# Altium project LED_PCB_v1.0.PrjPcb
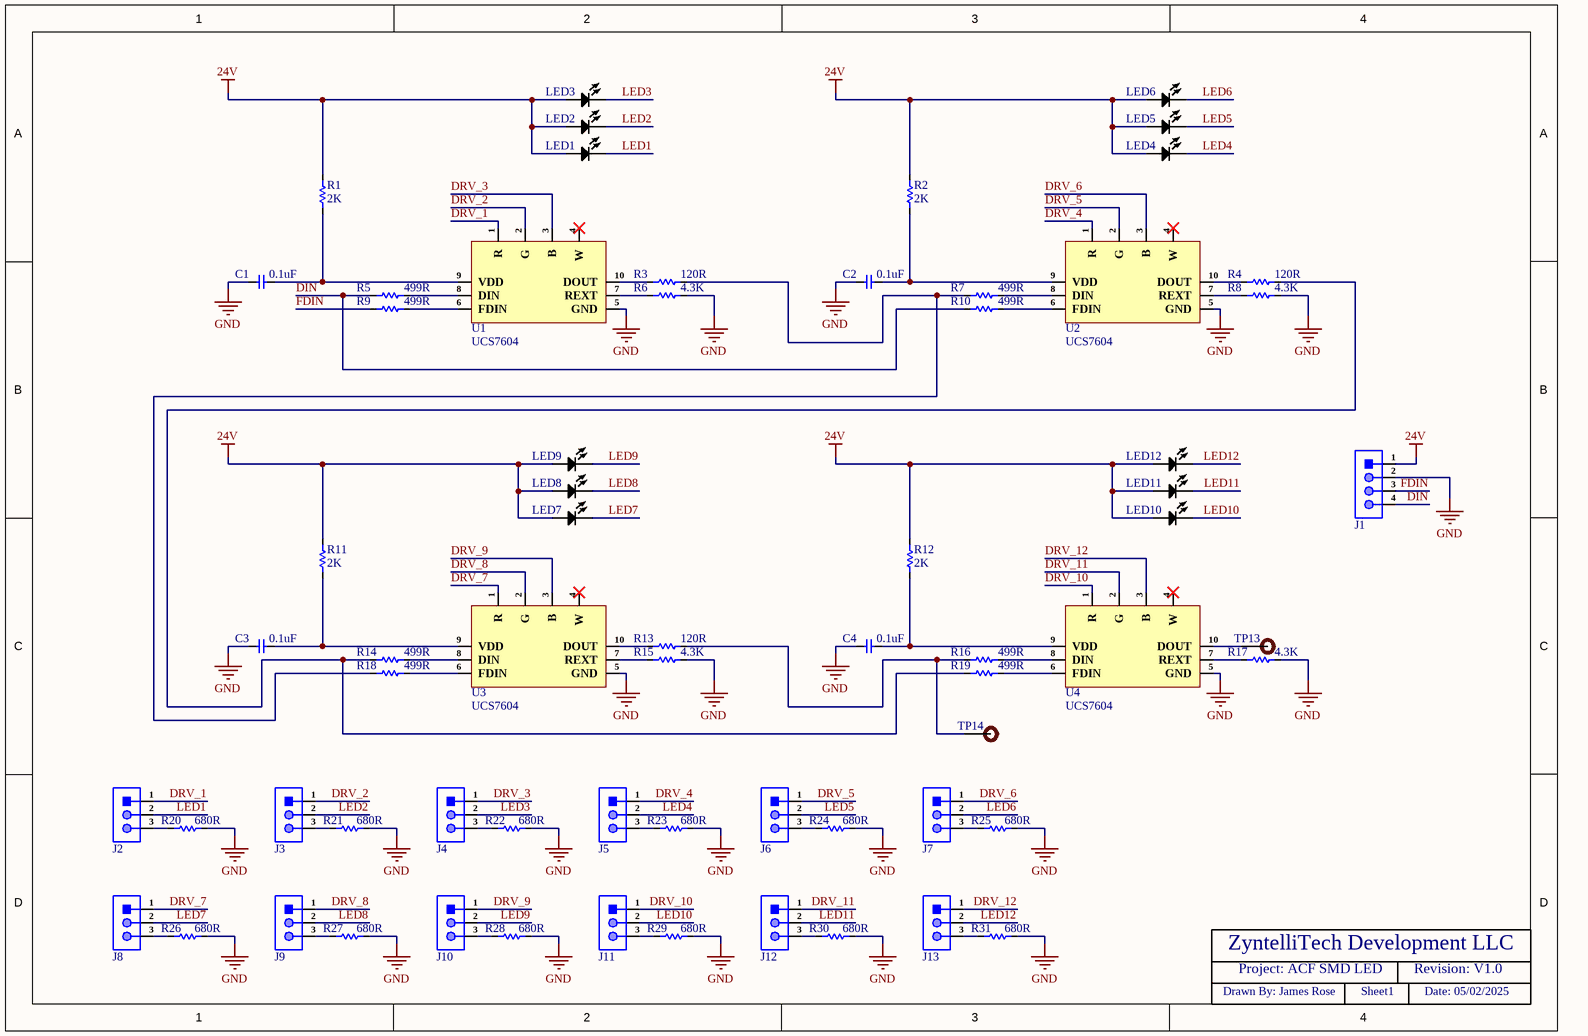
[diagram p0: Sheet1.SchDoc]
1 sheet, 66 parts. Net scope: global (net labels, ports and power ports of the same name join across sheets).
Board file: LED_PCB_v1.0.PcbDoc

## Sheet Sheet1.SchDoc
size A4; DrawnBy: James Rose; SheetNumber: 1; SheetTotal: 1; Validator: James Rose

### Parts
C1  0.1uF  [Cap-0603]
C2  0.1uF  [Cap-0603]
C3  0.1uF  [Cap-0603]
C4  0.1uF  [Cap-0603]
J1  X6511WV-04H-C60D30  [HDR1X4_]  (value not drawn)
J2  X6511WV-03H-C60D30  [HDR1X3_]  (value not drawn)
J3  X6511WV-03H-C60D30  [HDR1X3_]  (value not drawn)
J4  X6511WV-03H-C60D30  [HDR1X3_]  (value not drawn)
J5  X6511WV-03H-C60D30  [HDR1X3_]  (value not drawn)
J6  X6511WV-03H-C60D30  [HDR1X3_]  (value not drawn)
J7  X6511WV-03H-C60D30  [HDR1X3_]  (value not drawn)
J8  X6511WV-03H-C60D30  [HDR1X3_]  (value not drawn)
J9  X6511WV-03H-C60D30  [HDR1X3_]  (value not drawn)
J10  X6511WV-03H-C60D30  [HDR1X3_]  (value not drawn)
J11  X6511WV-03H-C60D30  [HDR1X3_]  (value not drawn)
J12  X6511WV-03H-C60D30  [HDR1X3_]  (value not drawn)
J13  X6511WV-03H-C60D30  [HDR1X3_]  (value not drawn)
LED1  5050 LED  [5050 LED]  (value not drawn)
LED2  5050 LED  [5050 LED]  (value not drawn)
LED3  5050 LED  [5050 LED]  (value not drawn)
LED4  5050 LED  [5050 LED]  (value not drawn)
LED5  5050 LED  [5050 LED]  (value not drawn)
LED6  5050 LED  [5050 LED]  (value not drawn)
LED7  5050 LED  [5050 LED]  (value not drawn)
LED8  5050 LED  [5050 LED]  (value not drawn)
LED9  5050 LED  [5050 LED]  (value not drawn)
LED10  5050 LED  [5050 LED]  (value not drawn)
LED11  5050 LED  [5050 LED]  (value not drawn)
LED12  5050 LED  [5050 LED]  (value not drawn)
R1  2K  [Res-1206]
R2  2K  [Res-1206]
R3  120R  [Res-0603]
R4  120R  [Res-0603]
R5  499R  [Res-0603]
R6  4.3K  [Res-0402]
R7  499R  [Res-0603]
R8  4.3K  [Res-0402]
R9  499R  [Res-0603]
R10  499R  [Res-0603]
R11  2K  [Res-1206]
R12  2K  [Res-1206]
R13  120R  [Res-0603]
R14  499R  [Res-0603]
R15  4.3K  [Res-0402]
R16  499R  [Res-0603]
R17  4.3K  [Res-0402]
R18  499R  [Res-0603]
R19  499R  [Res-0603]
R20  680R  [Res-0603]
R21  680R  [Res-0603]
R22  680R  [Res-0603]
R23  680R  [Res-0603]
R24  680R  [Res-0603]
R25  680R  [Res-0603]
R26  680R  [Res-0603]
R27  680R  [Res-0603]
R28  680R  [Res-0603]
R29  680R  [Res-0603]
R30  680R  [Res-0603]
R31  680R  [Res-0603]
TP13  0.5mm Test Pad  [0.5mm Test Pad]  (value not drawn)  (no BOM)
TP14  0.5mm Test Pad  [0.5mm Test Pad]  (value not drawn)  (no BOM)
U1  UCS7604  [SOP-10]
U2  UCS7604  [SOP-10]
U3  UCS7604  [SOP-10]
U4  UCS7604  [SOP-10]

### Nets
24V: J1.1 LED1.A LED2.A LED3.A LED4.A LED5.A LED6.A LED7.A LED8.A LED9.A LED10.A LED11.A LED12.A R1.2 R2.2 R11.2 R12.2
GND: C1.1 C2.1 C3.1 C4.1 J1.2 R6.2 R8.2 R15.2 R17.2 R20.2 R21.2 R22.2 R23.2 R24.2 R25.2 R26.2 R27.2 R28.2 R29.2 R30.2 R31.2 U1.5(GND) U2.5(GND) U3.5(GND) U4.5(GND)
DIN: J1.4 R5.1 R10.1
DRV_1: J2.1 U1.1(R)
DRV_2: J3.1 U1.2(G)
DRV_3: J4.1 U1.3(B)
DRV_4: J5.1 U2.1(R)
DRV_5: J6.1 U2.2(G)
DRV_6: J7.1 U2.3(B)
DRV_7: J8.1 U3.1(R)
DRV_8: J9.1 U3.2(G)
DRV_9: J10.1 U3.3(B)
DRV_10: J11.1 U4.1(R)
DRV_11: J12.1 U4.2(G)
DRV_12: J13.1 U4.3(B)
FDIN: J1.3 R9.1
LED1: J2.2 LED1.K
LED2: J3.2 LED2.K
LED3: J4.2 LED3.K
LED4: J5.2 LED4.K
LED5: J6.2 LED5.K
LED6: J7.2 LED6.K
LED7: J8.2 LED7.K
LED8: J9.2 LED8.K
LED9: J10.2 LED9.K
LED10: J11.2 LED10.K
LED11: J12.2 LED11.K
LED12: J13.2 LED12.K
NetC1_2: C1.2 R1.1 U1.9(VDD)
NetC2_2: C2.2 R2.1 U2.9(VDD)
NetC3_2: C3.2 R11.1 U3.9(VDD)
NetC4_2: C4.2 R12.1 U4.9(VDD)
NetJ2_3: J2.3 R20.1
NetJ3_3: J3.3 R21.1
NetJ4_3: J4.3 R22.1
NetJ5_3: J5.3 R23.1
NetJ6_3: J6.3 R24.1
NetJ7_3: J7.3 R25.1
NetJ8_3: J8.3 R26.1
NetJ9_3: J9.3 R27.1
NetJ10_3: J10.3 R28.1
NetJ11_3: J11.3 R29.1
NetJ12_3: J12.3 R30.1
NetJ13_3: J13.3 R31.1
NetR3_1: R3.1 U1.10(DOUT)
NetR3_2: R3.2 R7.1 R18.1
NetR4_1: R4.1 U2.10(DOUT)
NetR4_2: R4.2 R14.1 R19.1
NetR5_2: R5.2 U1.8(DIN)
NetR6_1: R6.1 U1.7(REXT)
NetR7_2: R7.2 U2.8(DIN)
NetR8_1: R8.1 U2.7(REXT)
NetR9_2: R9.2 U1.6(FDIN)
NetR10_2: R10.2 U2.6(FDIN)
NetR13_1: R13.1 U3.10(DOUT)
NetR13_2: R13.2 R16.1 TP14.1
NetR14_2: R14.2 U3.8(DIN)
NetR15_1: R15.1 U3.7(REXT)
NetR16_2: R16.2 U4.8(DIN)
NetR17_1: R17.1 U4.7(REXT)
NetR18_2: R18.2 U3.6(FDIN)
NetR19_2: R19.2 U4.6(FDIN)
NetTP13_1: TP13.1 U4.10(DOUT)

Not connected (* = marked no-connect by the designer): U1 4(W)*; U2 4(W)*; U3 4(W)*; U4 4(W)*

### Notes on the sheet
- ZyntelliTech Development LLC
- Project: ACF SMD LED
- Revision: V1.0
- Drawn By: James Rose
- Sheet1
- Date: 05/02/2025
- DWG. NO.
- REV.
- SHT.
- THIS DOCUMENT AND THE DATA DISCLOSED HEREIN OR HEREWITH IS THE PROPERTY OF ALTIUM LIMITED AND MAY BE FREELY DISTRIBUTED IN WHOLE. NO RIGHTS ARE RESERVED OR EXPRESS OR IMPLIED WARANTEE GIVEN.
- REVISION
- DESCRIPTION
- DATE
- APPROVED
- ENG:
- APPROVALS
- PROJECT
- DSN:
- CHK:
- REFERENCE DOCUMENTS
- PROJECT REVISION:
- TITLE
- DOCUMENT REVISION:
- DESIGN ITEM:
- BOM:
- FAB DWG:
- PCB DWG:
- ASSY DWG:
- SCALE:
- SIZE
- B
- CAGE CODE
- FILE NAME
- DWG NO.
- SHEET
- OF
- REV

### Library data of the parts
C1-C4 = CC0603JRX7R9BB104: CAP CER 0.1UF 50V X7R 0603; Manufacturer: Yageo; Item Type: Capacitors; Material: 4241ConductorMaterial; Supplier: Future Electronics; LCSC Part Number: C91183; Manufacturer Part Number: CC0603JRX7R9BB104; RoHS: Yes; Stock: 204000; Pricing: 4000=0.0077, 16000=0.0073, 60000=0.007, 160000=0.0068, 400000=0.0064 (USD); Pins: 2NUMBER; Lead Free: 5697LeadFree; Halogen Free: 5694HalogenFree; ComponentLink1URL: https://datasheet.ciiva.com/11465/upy-gphc-x7r-6-3v-to-50v-8-11465038.pdf?src-supplier=Avnet; ComponentLink1Description: https://datasheet.ciiva.com/11465/upy-gphc-x7r-6-3v-to-50v-8-11465038.pdf?src-supplier=Avnet
J1 = X6511WV-04H-C60D30: Gold 250V 3A Straight Square Pins 2.5mm 4P 260℃ 6mm -40℃~+105℃ 3mm 2.54mm Plugin Black Brass 1x4P Plugin,P=2.54mm Pin Headers ROHS; Manufacturer: XKB; Item Type: Male Header; ComponentLink1Description: LCSC; ComponentLink1URL: https://www.lcsc.com/product-detail/Pin-Headers_XKB-Connectivity-X6511WV-04H-C60D30_C706876.html; Manufacturer Part Number: X6511WV-04H-C60D30; Package: Plugin,P=2.54mm; LCSC Part Number: C706876
J2-J13 = X6511WV-03H-C60D30: Gold 250V 3A Straight Square Pins 2.5mm 3P 260℃ 6mm -40℃~+105℃ 3mm 2.54mm Plugin Black Brass 1x3P Plugin,P=2.54mm Pin Headers ROHS; Manufacturer: XKB; Item Type: Male Header; Manufacturer Part Number: X6511WV-03H-C60D30; Package: Plugin,P=2.54mm; LCSC Part Number: C706875; ComponentLink1Description: LCSC; ComponentLink1URL: https://www.lcsc.com/product-detail/Pin-Headers_XKB-Connectivity-X6511WV-03H-C60D30_C706875.html
LED1-LED12 = 5050 LED: -; ComponentLink1Description: LCSC; ComponentLink1URL: *
R1 R2 R11 R12 = RC1206FR-072KL: RES 2K OHM 1% 1/4W 1206; Manufacturer: Yageo; Item Type: Resistors; Value: 2kR; Power Rating: 250mW; Voltage Rating: 200V; Temperature Coefficient: 100ppm/°C; Supplier: Future Electronics; LCSC Part Number: C133543; Manufacturer Part Number: RC1206FR-072KL; RoHS: Yes; Stock: 45000; Pricing: 5000=0.003, 20000=0.0029, 75000=0.0028, 150000=0.0027, 375000=0.0026 (USD); Mounting Technology: Surface Mount; Case/Package: 1206; Case Code (Imperial): 1206; Case Code (Metric): 3216; Min Operating Temperature: -55°C; Max Operating Temperature: 155°C; Tolerance: 1%; Packaging: Tape and Reel; Termination: SMD/SMT; Working Voltage: 200V; Number of Terminations: 2; Features: Moisture Resistant; Series: RC; Max Power Dissipation: 250mW; Technology: THICK FILM; Voltage Rating (DC): 200V; Length: 3.1mm; Width: 1.6mm; Height: 0.55mm; Depth: 1.6mm; RoHS Compliant: Yes; Lead Free: 5697LeadFree; ComponentLink1URL: https://datasheet.ciiva.com/11808/0900766b80c6630a-11808949.pdf?src-supplier=Rs; ComponentLink1Description: https://datasheet.ciiva.com/11808/0900766b80c6630a-11808949.pdf?src-supplier=Rs; ComponentLink2URL: https://datasheet.ciiva.com/16740/pyu-rc1206-51-rohs-l-4-16740842.pdf?src-supplier=Future+Electronics; ComponentLink2Description: https://datasheet.ciiva.com/16740/pyu-rc1206-51-rohs-l-4-16740842.pdf?src-supplier=Future+Electronics
R3 R4 R13 = RC0603FR-07120RL: RES 120 OHM 1% 1/10W 0603; Manufacturer: Yageo; Temperature Coefficient: 100ppm/°C; Voltage Rating (DC): 50V; Power Rating: 100mW; Item Type: Resistor; Supplier 1: Digi-Key; Manufacturer Part Number: RC0603FR-07120RL; RoHS: Yes; Category: Chip SMD Resistors; Stock 1: 839061; Pricing 1: 1=0.10000, 10=0.02400, 100=0.00970, 1000=0.00436, 2500=0.00378 (USD); Case/Package: 0603; Number of Pins: 2; Case Code (Metric): 1608; Case Code (Imperial): 0603; Size Code: 0603; Min Operating Temperature: -55°C; Max Operating Temperature: 155°C; Resistance: 120R; Tolerance: 1%; Resistor Type: Thick Film; Packaging: Tape and Reel; Voltage Rating: 50V; Package Quantity: 1; Number of Terminations: 2; Termination: SMD/SMT; Max Power Dissipation: 100mW; Features: Moisture Resistant; Series: RC; Construction: Rectangular; Resistance Tolerance: 1%; Length: 1.6mm; Width: 0.031inch; Height: 0.022inch; Depth: 0.8mm; REACH SVHC: No SVHC; Lead Free: Lead Free; Military Standard: Not; RoHS Compliant: Yes; ComponentLink1URL: https://datasheet.ciiva.com/2553/pyu-r-int-thick-7-2553512.pdf?src-supplier=Digi-Key; ComponentLink1Description: https://datasheet.ciiva.com/2553/pyu-r-int-thick-7-2553512.pdf?src-supplier=Digi-Key; ComponentLink2URL: https://datasheet.ciiva.com/7746/443971-7746248.pdf?src-supplier=Element14; ComponentLink2Description: https://datasheet.ciiva.com/7746/443971-7746248.pdf?src-supplier=Element14; ComponentLink3URL: https://datasheet.ciiva.com/2553/pyu-r-int-thick-7-2553513.pdf?src-supplier=Digi-Key; ComponentLink3Description: https://datasheet.ciiva.com/2553/pyu-r-int-thick-7-2553513.pdf?src-supplier=Digi-Key; ComponentLink4URL: https://datasheet.ciiva.com/7746/443971-7746249.pdf?src-supplier=Element14; ComponentLink4Description: https://datasheet.ciiva.com/7746/443971-7746249.pdf?src-supplier=Element14; ComponentLink5URL: https://datasheet.ciiva.com/2553/pyu-r-int-thick-7-2553514.pdf?src-supplier=Digi-Key; ComponentLink5Description: https://datasheet.ciiva.com/2553/pyu-r-int-thick-7-2553514.pdf?src-supplier=Digi-Key; ComponentLink6URL: https://datasheet.ciiva.com/46395/443971-46395021.pdf?src-supplier=Element14; ComponentLink6Description: https://datasheet.ciiva.com/46395/443971-46395021.pdf?src-supplier=Element14; Supplier Part Number 1: 311-120HRCT-ND; LCSC Part Number: C114640
R5 R7 R9 R10 R14 R16 R18 R19 = RC0603FR-07499RL: RES 499 OHM 1% 1/10W 0603; Manufacturer: Yageo; Temperature Coefficient: 100ppm/°C; Power Rating: 100mW; Voltage Rating: 50V; Supplier 1: RSComponents; Manufacturer Part Number: RC0603FR-07499RL; RoHS: Yes; Category: Chip SMD Resistors; Stock 1: 900; Pricing 1: 5000=0.00300, 10000=0.00300, 15000=0.00300, 20000=0.00200 (GBP); Mount: Surface Mount; Case/Package: 0603; Contact Plating: Tin,Matte; Case Code (Metric): 1608; Case Code (Imperial): 0603; Size Code: 0603; Min Operating Temperature: -55°C; Max Operating Temperature: 155°C; Resistance: 499R; Tolerance: 1%; Resistor Type: Thick Film; Package Quantity: 1; Packaging: Tape and Reel; Number of Terminations: 2; Termination: SMD/SMT; Max Power Dissipation: 100mW; Voltage Rating (DC): 50V; Features: Moisture Resistant; Series: RC; Construction: Rectangular; Technology: THICK FILM; Length: 1.6mm; Width: 0.031inch; Height: 0.45mm; Depth: 0.8mm; Radiation Hardening: No; Military Standard: Not; Lead Free: Lead Free; RoHS Compliant: Yes; ComponentLink1URL: https://datasheet.ciiva.com/11808/0900766b80f96399-11808558.pdf?src-supplier=RSComponents; ComponentLink1Description: https://datasheet.ciiva.com/11808/0900766b80f96399-11808558.pdf?src-supplier=RSComponents; ComponentLink2URL: https://datasheet.ciiva.com/2453/pyu-r-int-thick-7-2453956.pdf?src-supplier=Digi-Key; ComponentLink2Description: https://datasheet.ciiva.com/2453/pyu-r-int-thick-7-2453956.pdf?src-supplier=Digi-Key; ComponentLink3URL: https://datasheet.ciiva.com/2453/pyu-r-int-thick-7-2453957.pdf?src-supplier=Digi-Key; ComponentLink3Description: https://datasheet.ciiva.com/2453/pyu-r-int-thick-7-2453957.pdf?src-supplier=Digi-Key; ComponentLink4URL: https://datasheet.ciiva.com/2453/pyu-r-int-thick-7-2453955.pdf?src-supplier=Digi-Key; ComponentLink4Description: https://datasheet.ciiva.com/2453/pyu-r-int-thick-7-2453955.pdf?src-supplier=Digi-Key; ComponentLink5URL: https://datasheet.ciiva.com/12558/rc0603-272842-12558391.pdf?src-supplier=Mouser; ComponentLink5Description: https://datasheet.ciiva.com/12558/rc0603-272842-12558391.pdf?src-supplier=Mouser; ComponentLink6URL: https://datasheet.ciiva.com/8885/pyu-rc0603-51-rohs-l-4-8885483.pdf?src-supplier=Avnet; ComponentLink6Description: https://datasheet.ciiva.com/8885/pyu-rc0603-51-rohs-l-4-8885483.pdf?src-supplier=Avnet; Supplier Part Number 1: 1995585; LCSC Part Number: C137714
R6 R8 R15 R17 = RC0402FR-074K3L: RES 4.3K OHM 1% 1/16W 0402; Manufacturer: Yageo; Item Type: Resistors; Value: 4.3kR; Temperature Coefficient: 100ppm/°C; Power Rating: 63mW; Voltage Rating: 50V; Supplier: Future Electronics; LCSC Part Number: C477725; Manufacturer Part Number: RC0402FR-074K3L; RoHS: Yes; Stock: 200000; Pricing: 10000=0.0005, 100000=0.0005, 300000=0.0004, 750000=0.0004, 2000000=0.0004 (USD); Case/Package: 0402; Contact Plating: Tin,Matte; Case Code (Imperial): 0402; Case Code (Metric): 1005; Min Operating Temperature: -55°C; Max Operating Temperature: 155°C; Tolerance: 1%; Resistor Type: Thick Film; Packaging: Tape and Reel; Termination: SMD/SMT; Voltage Rating (DC): 50V; Features: Moisture Resistant; Series: RC; Max Power Dissipation: 63mW; Number of Terminations: 2; Construction: Rectangular; Resistance Tolerance: 1%; Length: 1mm; Depth: 0.5mm; Military Standard: Not; Lead Free: Lead Free; RoHS Compliant: Yes; Reach SVHC Compliant: Unknown; ComponentLink1URL: https://datasheet.ciiva.com/7850/1018594-7850021.pdf?src-supplier=Element14; ComponentLink1Description: https://datasheet.ciiva.com/7850/1018594-7850021.pdf?src-supplier=Element14; ComponentLink2URL: https://datasheet.ciiva.com/12666/pyu-rc0402-51-rohs-l-6-r-12666953.pdf?src-supplier=Mouser; ComponentLink2Description: https://datasheet.ciiva.com/12666/pyu-rc0402-51-rohs-l-6-r-12666953.pdf?src-supplier=Mouser; ComponentLink3URL: https://datasheet.ciiva.com/8893/pyu-rc0402-51-rohs-l-6-8893173.pdf?src-supplier=Avnet; ComponentLink3Description: https://datasheet.ciiva.com/8893/pyu-rc0402-51-rohs-l-6-8893173.pdf?src-supplier=Avnet; ComponentLink4URL: https://datasheet.ciiva.com/17086/pyu-rc0402-51-rohs-l-6-r-17086539.pdf?src-supplier=Future+Electronics; ComponentLink4Description: https://datasheet.ciiva.com/17086/pyu-rc0402-51-rohs-l-6-r-17086539.pdf?src-supplier=Future+Electronics
R20-R31 = RC0603FR-07680RL: RES SMD 680 OHM 1% 1/10W 0603; Manufacturer: Yageo; Item Type: Resistor; Manufacturer Part Number: RC0603FR-07680RL; Package: 0603; ComponentLink4URL: https://www.lcsc.com/product-detail/Chip-Resistor-Surface-Mount_YAGEO-RC0603FR-07680RL_C112310.html; ComponentLink4Description: LCSC; LCSC Part Number: C112310
TP13 TP14 = 0.5mm Test Pad: Test pad
U1-U4 = UCS7604: RGBW LED Driver; Manufacturer: UCS; Item Type: IC; Manufacturer Part Number: UCS7604; Package: SOP-10; LCSC Part Number: -; ComponentLink1Description: UCS; ComponentLink1URL: https://suntechlite.com/ucs7604-specification-sheet-download/